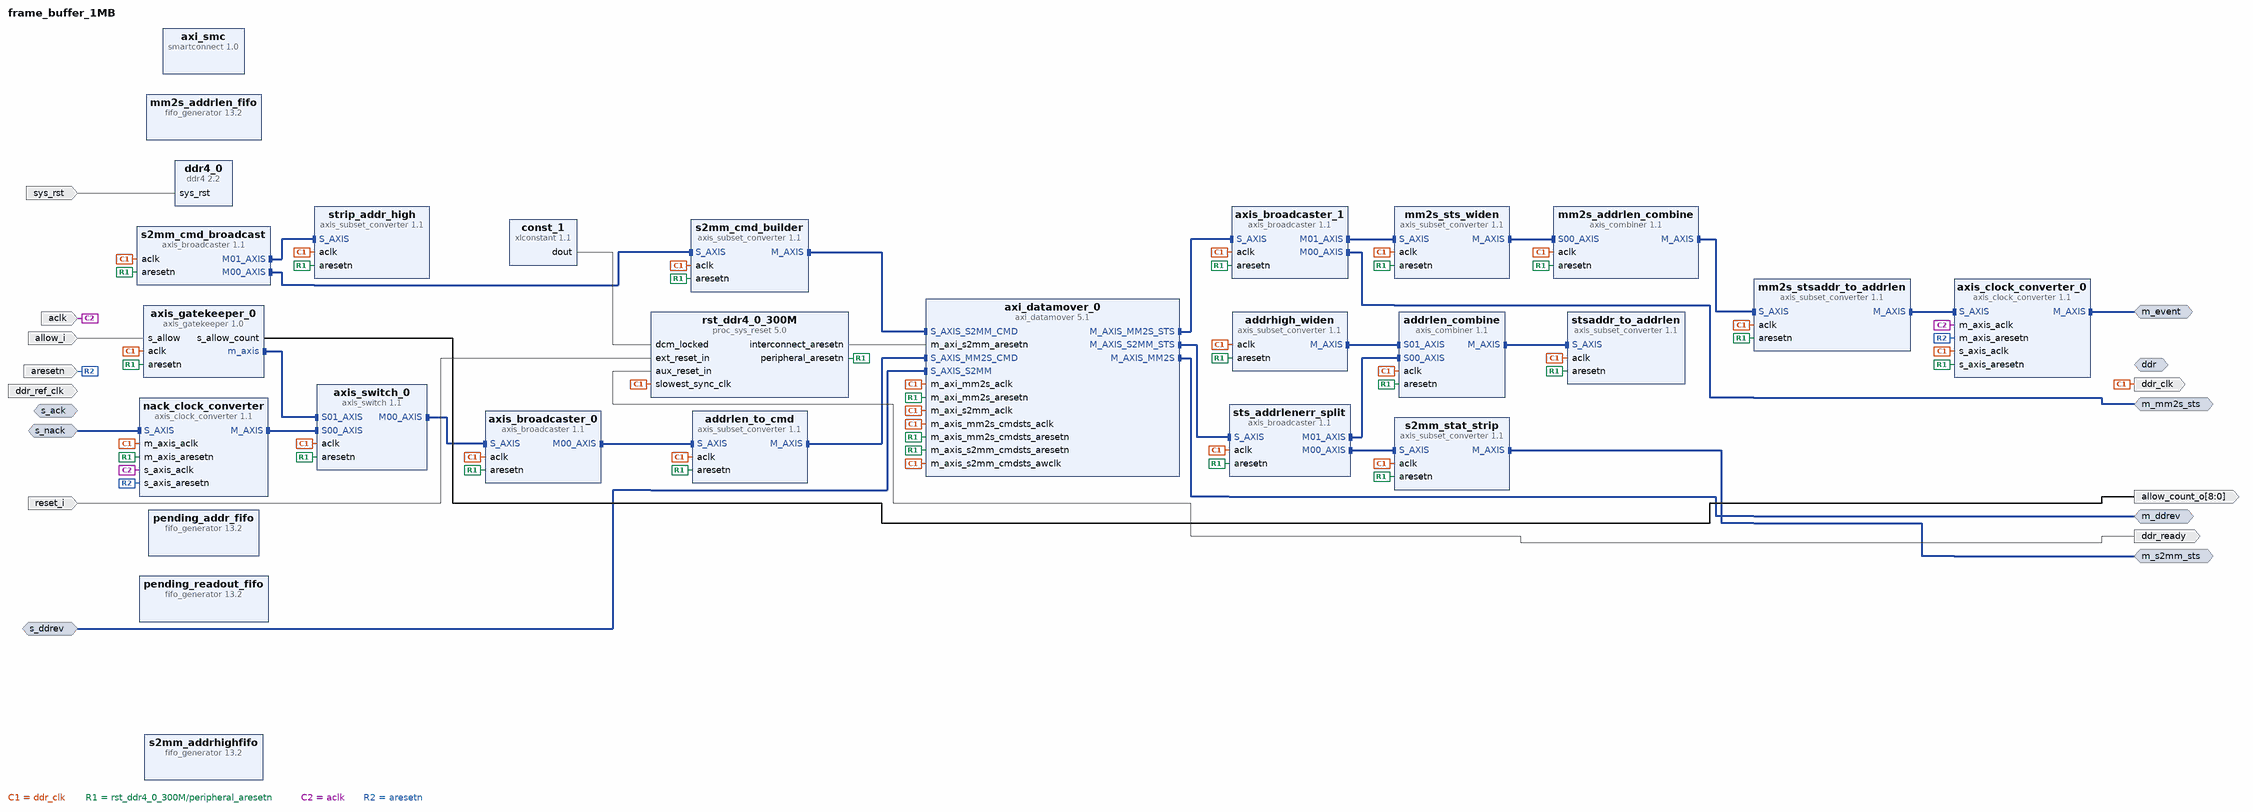
[diagram p0: block diagram of the top level]
# Vivado block design frame_buffer_1MB, xcku3p-ffvb676-2-e, Vivado 2022.2
create_bd_design frame_buffer_1MB

create_bd_intf_port -mode Slave -vlnv xilinx.com:interface:axis_rtl:1.0 s_nack
set_property -dict [list \
  CONFIG.HAS_TKEEP 0 \
  CONFIG.HAS_TLAST 0 \
  CONFIG.HAS_TREADY 1 \
  CONFIG.HAS_TSTRB 0 \
  CONFIG.LAYERED_METADATA undef \
  CONFIG.TDATA_NUM_BYTES 4 \
  CONFIG.TDEST_WIDTH 0 \
  CONFIG.TID_WIDTH 0 \
  CONFIG.TUSER_WIDTH 0 \
] [get_bd_intf_ports s_nack]
create_bd_intf_port -mode Master -vlnv xilinx.com:interface:axis_rtl:1.0 m_s2mm_sts
create_bd_intf_port -mode Master -vlnv xilinx.com:interface:ddr4_rtl:1.0 ddr
create_bd_intf_port -mode Slave -vlnv xilinx.com:interface:axis_rtl:1.0 s_ddrev
set_property -dict [list \
  CONFIG.HAS_TKEEP 1 \
  CONFIG.HAS_TLAST 1 \
  CONFIG.HAS_TREADY 1 \
  CONFIG.HAS_TSTRB 0 \
  CONFIG.LAYERED_METADATA undef \
  CONFIG.TDATA_NUM_BYTES 32 \
  CONFIG.TDEST_WIDTH 0 \
  CONFIG.TID_WIDTH 0 \
  CONFIG.TUSER_WIDTH 0 \
] [get_bd_intf_ports s_ddrev]
create_bd_intf_port -mode Slave -vlnv xilinx.com:interface:axis_rtl:1.0 s_ack
set_property -dict [list \
  CONFIG.FREQ_HZ 156250000 \
  CONFIG.HAS_TKEEP 0 \
  CONFIG.HAS_TLAST 0 \
  CONFIG.HAS_TREADY 1 \
  CONFIG.HAS_TSTRB 0 \
  CONFIG.LAYERED_METADATA undef \
  CONFIG.TDATA_NUM_BYTES 2 \
  CONFIG.TDEST_WIDTH 0 \
  CONFIG.TID_WIDTH 0 \
  CONFIG.TUSER_WIDTH 0 \
] [get_bd_intf_ports s_ack]
create_bd_intf_port -mode Master -vlnv xilinx.com:interface:axis_rtl:1.0 m_ddrev
create_bd_intf_port -mode Master -vlnv xilinx.com:interface:axis_rtl:1.0 m_mm2s_sts
create_bd_intf_port -mode Master -vlnv xilinx.com:interface:axis_rtl:1.0 m_event
set_property -dict {CONFIG.FREQ_HZ 156250000} [get_bd_intf_ports m_event]
create_bd_port -dir I -type clk ddr_ref_clk
set_property -dict {CONFIG.FREQ_HZ 166750000 CONFIG.INSERT_VIP 1 CONFIG.PHASE 0} [get_bd_ports ddr_ref_clk]
create_bd_port -dir I -type rst reset_i
set_property -dict {CONFIG.POLARITY ACTIVE_HIGH} [get_bd_ports reset_i]
create_bd_port -dir I allow_i
create_bd_port -dir O -from 8 -to 0 allow_count_o
create_bd_port -dir O ddr_ready
create_bd_port -dir O -type clk ddr_clk
set_property -dict {CONFIG.ASSOCIATED_BUSIF s_ddrev:m_ddrev:m_mm2s_sts:m_s2mm_sts} [get_bd_ports ddr_clk]
create_bd_port -dir I -type clk aclk
set_property -dict [list \
  CONFIG.ASSOCIATED_BUSIF s_nack:m_event:s_ack \
  CONFIG.ASSOCIATED_RESET aresetn \
  CONFIG.FREQ_HZ 156250000 \
] [get_bd_ports aclk]
create_bd_port -dir I -type rst aresetn
create_bd_port -dir I -type rst sys_rst
set_property -dict {CONFIG.POLARITY ACTIVE_HIGH} [get_bd_ports sys_rst]

create_bd_cell -type ip -vlnv xilinx.com:ip:proc_sys_reset:5.0 rst_ddr4_0_300M
set_property -dict {CONFIG.C_AUX_RESET_HIGH 0} [get_bd_cells rst_ddr4_0_300M]
create_bd_cell -type ip -vlnv ohio-state.edu:user:axis_gatekeeper:1.0 axis_gatekeeper_0
set_property -dict {CONFIG.C_AXIS_DATA_BYTES 4} [get_bd_cells axis_gatekeeper_0]
create_bd_cell -type ip -vlnv xilinx.com:ip:axis_combiner:1.1 mm2s_addrlen_combine
set_property -dict {CONFIG.TDATA_NUM_BYTES 4} [get_bd_cells mm2s_addrlen_combine]
create_bd_cell -type ip -vlnv xilinx.com:ip:axi_datamover:5.1 axi_datamover_0
set_property -dict [list \
  CONFIG.c_dummy 0 \
  CONFIG.c_m_axi_mm2s_data_width 256 \
  CONFIG.c_m_axi_mm2s_id_width 0 \
  CONFIG.c_m_axi_s2mm_data_width 256 \
  CONFIG.c_m_axi_s2mm_id_width 0 \
  CONFIG.c_m_axis_mm2s_tdata_width 256 \
  CONFIG.c_mm2s_btt_used 20 \
  CONFIG.c_mm2s_burst_size 16 \
  CONFIG.c_mm2s_include_sf true \
  CONFIG.c_mm2s_stscmd_is_async false \
  CONFIG.c_s2mm_btt_used 20 \
  CONFIG.c_s2mm_burst_size 16 \
  CONFIG.c_s2mm_stscmd_is_async false \
  CONFIG.c_s2mm_support_indet_btt true \
  CONFIG.c_s_axis_s2mm_tdata_width 256 \
  CONFIG.c_single_interface 1 \
] [get_bd_cells axi_datamover_0]
create_bd_cell -type ip -vlnv xilinx.com:ip:smartconnect:1.0 axi_smc
set_property -dict {CONFIG.NUM_SI 1} [get_bd_cells axi_smc]
create_bd_cell -type ip -vlnv xilinx.com:ip:axis_broadcaster:1.1 sts_addrlenerr_split
set_property -dict [list \
  CONFIG.M00_TDATA_REMAP {24'b000000000000000000000000,tdata[7:0]} \
  CONFIG.M01_TDATA_REMAP {tdata[31:8],4'b0000,tdata[3:0]} \
  CONFIG.M02_TDATA_REMAP {tdata[7:0]} \
  CONFIG.M03_TDATA_REMAP {tdata[7:0]} \
  CONFIG.M_TDATA_NUM_BYTES 4 \
  CONFIG.NUM_MI 2 \
  CONFIG.S_TDATA_NUM_BYTES 4 \
] [get_bd_cells sts_addrlenerr_split]
create_bd_cell -type ip -vlnv xilinx.com:ip:axis_broadcaster:1.1 axis_broadcaster_0
set_property -dict [list \
  CONFIG.M00_TDATA_REMAP {tdata[31:0]} \
  CONFIG.M01_TDATA_REMAP {tdata[31:24],4'b0000,tdata[19:0]} \
  CONFIG.M_TDATA_NUM_BYTES 4 \
  CONFIG.S_TDATA_NUM_BYTES 4 \
] [get_bd_cells axis_broadcaster_0]
create_bd_cell -type ip -vlnv xilinx.com:ip:axis_broadcaster:1.1 s2mm_cmd_broadcast
set_property -dict [list \
  CONFIG.M00_TDATA_REMAP {4'b0000,tdata[11:0]} \
  CONFIG.M01_TDATA_REMAP {4'b0000,tdata[11:0]} \
  CONFIG.M_TDATA_NUM_BYTES 2 \
  CONFIG.S_TDATA_NUM_BYTES 2 \
] [get_bd_cells s2mm_cmd_broadcast]
create_bd_cell -type ip -vlnv xilinx.com:ip:axis_broadcaster:1.1 axis_broadcaster_1
create_bd_cell -type ip -vlnv xilinx.com:ip:axis_clock_converter:1.1 nack_clock_converter
set_property -dict {CONFIG.TDATA_NUM_BYTES 4} [get_bd_cells nack_clock_converter]
create_bd_cell -type ip -vlnv xilinx.com:ip:axis_clock_converter:1.1 axis_clock_converter_0
set_property -dict {CONFIG.TDATA_NUM_BYTES 4} [get_bd_cells axis_clock_converter_0]
create_bd_cell -type ip -vlnv xilinx.com:ip:axis_combiner:1.1 addrlen_combine
set_property -dict {CONFIG.TDATA_NUM_BYTES 4} [get_bd_cells addrlen_combine]
create_bd_cell -type ip -vlnv xilinx.com:ip:axis_subset_converter:1.1 stsaddr_to_addrlen
set_property -dict [list \
  CONFIG.M_TDATA_NUM_BYTES 4 \
  CONFIG.S_TDATA_NUM_BYTES 8 \
  CONFIG.TDATA_REMAP {tdata[39:32],tdata[3:0],tdata[27:8]} \
  CONFIG.TKEEP_REMAP {tkeep[3:0]} \
  CONFIG.TLAST_REMAP {tlast[0]} \
] [get_bd_cells stsaddr_to_addrlen]
create_bd_cell -type ip -vlnv xilinx.com:ip:axis_subset_converter:1.1 s2mm_cmd_builder
set_property -dict [list \
  CONFIG.M_TDATA_NUM_BYTES 9 \
  CONFIG.S_TDATA_NUM_BYTES 2 \
  CONFIG.TDATA_REMAP {4'b0000,tdata[3:0],tdata[11:0],20'b00000000000000000000,1'b0,1'b1,6'b000000,1'b1,3'b000,20'b11111111111111111111} \
] [get_bd_cells s2mm_cmd_builder]
create_bd_cell -type ip -vlnv xilinx.com:ip:axis_subset_converter:1.1 strip_addr_high
set_property -dict [list \
  CONFIG.M_TDATA_NUM_BYTES 1 \
  CONFIG.S_TDATA_NUM_BYTES 2 \
  CONFIG.TDATA_REMAP {tdata[11:4]} \
] [get_bd_cells strip_addr_high]
create_bd_cell -type ip -vlnv xilinx.com:ip:axis_subset_converter:1.1 s2mm_stat_strip
set_property -dict [list \
  CONFIG.TDATA_REMAP {tdata[31:0]} \
  CONFIG.TKEEP_REMAP {tkeep[3:0]} \
  CONFIG.TLAST_REMAP {tlast[0]} \
] [get_bd_cells s2mm_stat_strip]
create_bd_cell -type ip -vlnv xilinx.com:ip:axis_subset_converter:1.1 addrhigh_widen
set_property -dict [list \
  CONFIG.M_TDATA_NUM_BYTES 4 \
  CONFIG.TDATA_REMAP {24'b000000000000000000000000,tdata[7:0]} \
] [get_bd_cells addrhigh_widen]
create_bd_cell -type ip -vlnv xilinx.com:ip:axis_subset_converter:1.1 addrlen_to_cmd
set_property -dict [list \
  CONFIG.M_TDATA_NUM_BYTES 9 \
  CONFIG.S_TDATA_NUM_BYTES 4 \
  CONFIG.TDATA_REMAP {4'b0000,tdata[23:20],tdata[31:20],20'b00000000000000000000,1'b0,1'b1,6'b000000,1'b1,3'b000,tdata[19:0]} \
] [get_bd_cells addrlen_to_cmd]
create_bd_cell -type ip -vlnv xilinx.com:ip:axis_subset_converter:1.1 mm2s_sts_widen
set_property -dict [list \
  CONFIG.M_TDATA_NUM_BYTES 4 \
  CONFIG.TDATA_REMAP {24'b000000000000000000000000,tdata[7:0]} \
  CONFIG.TKEEP_REMAP {3'b111,tkeep[0:0]} \
  CONFIG.TLAST_REMAP {tlast[0]} \
] [get_bd_cells mm2s_sts_widen]
create_bd_cell -type ip -vlnv xilinx.com:ip:axis_switch:1.1 axis_switch_0
set_property -dict {CONFIG.ARB_ALGORITHM 1 CONFIG.TDATA_NUM_BYTES 4} [get_bd_cells axis_switch_0]
create_bd_cell -type ip -vlnv xilinx.com:ip:ddr4:2.2 ddr4_0
set_property -dict [list \
  CONFIG.ADDN_UI_CLKOUT1_FREQ_HZ 167 \
  CONFIG.C0.DDR4_AxiAddressWidth 32 \
  CONFIG.C0.DDR4_AxiDataWidth 256 \
  CONFIG.C0.DDR4_CasWriteLatency 12 \
  CONFIG.C0.DDR4_DataWidth 32 \
  CONFIG.C0.DDR4_InputClockPeriod 5997 \
  CONFIG.C0.DDR4_MemoryPart MT40A1G8WE-075E \
  CONFIG.C0.DDR4_TimePeriod 833 \
  CONFIG.C0.DDR4_nCK_TXPR 0 \
  CONFIG.System_Clock No_Buffer \
] [get_bd_cells ddr4_0]
create_bd_cell -type ip -vlnv xilinx.com:ip:fifo_generator:13.2 pending_readout_fifo
set_property -dict [list \
  CONFIG.FIFO_Implementation_axis Common_Clock_Builtin_FIFO \
  CONFIG.FIFO_Implementation_rach Common_Clock_Distributed_RAM \
  CONFIG.FIFO_Implementation_rdch Common_Clock_Builtin_FIFO \
  CONFIG.FIFO_Implementation_wach Common_Clock_Distributed_RAM \
  CONFIG.FIFO_Implementation_wdch Common_Clock_Builtin_FIFO \
  CONFIG.FIFO_Implementation_wrch Common_Clock_Distributed_RAM \
  CONFIG.INTERFACE_TYPE AXI_STREAM \
  CONFIG.TDATA_NUM_BYTES 4 \
  CONFIG.TUSER_WIDTH 0 \
] [get_bd_cells pending_readout_fifo]
create_bd_cell -type ip -vlnv xilinx.com:ip:fifo_generator:13.2 mm2s_addrlen_fifo
set_property -dict [list \
  CONFIG.FIFO_Implementation_axis Common_Clock_Distributed_RAM \
  CONFIG.FIFO_Implementation_rach Common_Clock_Distributed_RAM \
  CONFIG.FIFO_Implementation_rdch Common_Clock_Builtin_FIFO \
  CONFIG.FIFO_Implementation_wach Common_Clock_Distributed_RAM \
  CONFIG.FIFO_Implementation_wdch Common_Clock_Builtin_FIFO \
  CONFIG.FIFO_Implementation_wrch Common_Clock_Distributed_RAM \
  CONFIG.INTERFACE_TYPE AXI_STREAM \
  CONFIG.Input_Depth_axis 16 \
  CONFIG.TDATA_NUM_BYTES 4 \
  CONFIG.TUSER_WIDTH 0 \
] [get_bd_cells mm2s_addrlen_fifo]
create_bd_cell -type ip -vlnv xilinx.com:ip:fifo_generator:13.2 pending_addr_fifo
set_property -dict [list \
  CONFIG.Clock_Type_AXI Independent_Clock \
  CONFIG.FIFO_Implementation_axis Independent_Clocks_Builtin_FIFO \
  CONFIG.FIFO_Implementation_rach Independent_Clocks_Distributed_RAM \
  CONFIG.FIFO_Implementation_rdch Independent_Clocks_Builtin_FIFO \
  CONFIG.FIFO_Implementation_wach Independent_Clocks_Distributed_RAM \
  CONFIG.FIFO_Implementation_wdch Independent_Clocks_Builtin_FIFO \
  CONFIG.FIFO_Implementation_wrch Independent_Clocks_Distributed_RAM \
  CONFIG.INTERFACE_TYPE AXI_STREAM \
  CONFIG.Input_Depth_axis 4096 \
  CONFIG.TDATA_NUM_BYTES 2 \
  CONFIG.TUSER_WIDTH 0 \
] [get_bd_cells pending_addr_fifo]
create_bd_cell -type ip -vlnv xilinx.com:ip:fifo_generator:13.2 s2mm_addrhighfifo
set_property -dict [list \
  CONFIG.FIFO_Implementation_axis Common_Clock_Distributed_RAM \
  CONFIG.FIFO_Implementation_rach Common_Clock_Distributed_RAM \
  CONFIG.FIFO_Implementation_rdch Common_Clock_Builtin_FIFO \
  CONFIG.FIFO_Implementation_wach Common_Clock_Distributed_RAM \
  CONFIG.FIFO_Implementation_wdch Common_Clock_Builtin_FIFO \
  CONFIG.FIFO_Implementation_wrch Common_Clock_Distributed_RAM \
  CONFIG.Fifo_Implementation Common_Clock_Distributed_RAM \
  CONFIG.Full_Flags_Reset_Value 1 \
  CONFIG.INTERFACE_TYPE AXI_STREAM \
  CONFIG.Input_Depth_axis 16 \
  CONFIG.TUSER_WIDTH 0 \
] [get_bd_cells s2mm_addrhighfifo]
create_bd_cell -type ip -vlnv xilinx.com:ip:axis_subset_converter:1.1 mm2s_stsaddr_to_addrlen
set_property -dict [list \
  CONFIG.M_TDATA_NUM_BYTES 4 \
  CONFIG.S_TDATA_NUM_BYTES 8 \
  CONFIG.TDATA_REMAP {tdata[63:56],tdata[3:0],tdata[51:32]} \
  CONFIG.TKEEP_REMAP {tkeep[3:0]} \
  CONFIG.TLAST_REMAP {tlast[0]} \
] [get_bd_cells mm2s_stsaddr_to_addrlen]
create_bd_cell -type ip -vlnv xilinx.com:ip:xlconstant:1.1 const_1

# ---- connections ----

connect_bd_intf_net -intf_net S_AXIS_S2MM_0_1 [get_bd_intf_ports s_ddrev] [get_bd_intf_pins axi_datamover_0/S_AXIS_S2MM]
connect_bd_intf_net [get_bd_intf_pins addrlen_combine/M_AXIS] [get_bd_intf_pins stsaddr_to_addrlen/S_AXIS]
connect_bd_intf_net [get_bd_intf_pins addrlen_to_cmd/M_AXIS] [get_bd_intf_pins axi_datamover_0/S_AXIS_MM2S_CMD]
connect_bd_intf_net [get_bd_intf_ports m_ddrev] [get_bd_intf_pins axi_datamover_0/M_AXIS_MM2S]
connect_bd_intf_net [get_bd_intf_pins axi_datamover_0/M_AXIS_MM2S_STS] [get_bd_intf_pins axis_broadcaster_1/S_AXIS]
connect_bd_intf_net [get_bd_intf_pins axi_datamover_0/M_AXIS_S2MM_STS] [get_bd_intf_pins sts_addrlenerr_split/S_AXIS]
connect_bd_intf_net -intf_net axis_broadcaster_0_M00_AXIS [get_bd_intf_pins sts_addrlenerr_split/M00_AXIS] [get_bd_intf_pins s2mm_stat_strip/S_AXIS]
connect_bd_intf_net [get_bd_intf_pins axis_broadcaster_0/M00_AXIS] [get_bd_intf_pins addrlen_to_cmd/S_AXIS]
connect_bd_intf_net [get_bd_intf_ports m_mm2s_sts] [get_bd_intf_pins axis_broadcaster_1/M00_AXIS]
connect_bd_intf_net [get_bd_intf_pins axis_broadcaster_1/M01_AXIS] [get_bd_intf_pins mm2s_sts_widen/S_AXIS]
connect_bd_intf_net -intf_net axis_clock_converter_0_M_AXIS [get_bd_intf_pins axis_switch_0/S00_AXIS] [get_bd_intf_pins nack_clock_converter/M_AXIS]
connect_bd_intf_net [get_bd_intf_ports m_event] [get_bd_intf_pins axis_clock_converter_0/M_AXIS]
connect_bd_intf_net [get_bd_intf_pins axis_gatekeeper_0/m_axis] [get_bd_intf_pins axis_switch_0/S01_AXIS]
connect_bd_intf_net -intf_net axis_subset_converter_0_M_AXIS1 [get_bd_intf_pins addrhigh_widen/M_AXIS] [get_bd_intf_pins addrlen_combine/S01_AXIS]
connect_bd_intf_net [get_bd_intf_pins axis_switch_0/M00_AXIS] [get_bd_intf_pins axis_broadcaster_0/S_AXIS]
connect_bd_intf_net [get_bd_intf_pins mm2s_addrlen_combine/M_AXIS] [get_bd_intf_pins mm2s_stsaddr_to_addrlen/S_AXIS]
connect_bd_intf_net [get_bd_intf_pins mm2s_sts_widen/M_AXIS] [get_bd_intf_pins mm2s_addrlen_combine/S00_AXIS]
connect_bd_intf_net [get_bd_intf_pins mm2s_stsaddr_to_addrlen/M_AXIS] [get_bd_intf_pins axis_clock_converter_0/S_AXIS]
connect_bd_intf_net [get_bd_intf_pins s2mm_cmd_broadcast/M00_AXIS] [get_bd_intf_pins s2mm_cmd_builder/S_AXIS]
connect_bd_intf_net [get_bd_intf_pins strip_addr_high/S_AXIS] [get_bd_intf_pins s2mm_cmd_broadcast/M01_AXIS]
connect_bd_intf_net [get_bd_intf_pins s2mm_cmd_builder/M_AXIS] [get_bd_intf_pins axi_datamover_0/S_AXIS_S2MM_CMD]
connect_bd_intf_net [get_bd_intf_ports m_s2mm_sts] [get_bd_intf_pins s2mm_stat_strip/M_AXIS]
connect_bd_intf_net [get_bd_intf_ports s_nack] [get_bd_intf_pins nack_clock_converter/S_AXIS]
connect_bd_intf_net [get_bd_intf_pins sts_addrlenerr_split/M01_AXIS] [get_bd_intf_pins addrlen_combine/S00_AXIS]
connect_bd_net -net aux_reset_in_0_1 [get_bd_ports reset_i] [get_bd_pins rst_ddr4_0_300M/ext_reset_in]
connect_bd_net [get_bd_pins axis_gatekeeper_0/s_allow_count] [get_bd_ports allow_count_o]
# net c0_sys_clk_i_0_1 has one end: ddr_ref_clk
connect_bd_net [get_bd_pins const_1/dout] [get_bd_pins rst_ddr4_0_300M/dcm_locked]
connect_bd_net -net ddr4_0_c0_ddr4_ui_clk [get_bd_ports ddr_clk] \
  [get_bd_pins rst_ddr4_0_300M/slowest_sync_clk] [get_bd_pins axis_gatekeeper_0/aclk] [get_bd_pins mm2s_addrlen_combine/aclk] \
  [get_bd_pins axi_datamover_0/m_axi_mm2s_aclk] [get_bd_pins axi_datamover_0/m_axis_mm2s_cmdsts_aclk] \
  [get_bd_pins axi_datamover_0/m_axi_s2mm_aclk] [get_bd_pins axi_datamover_0/m_axis_s2mm_cmdsts_awclk] \
  [get_bd_pins sts_addrlenerr_split/aclk] [get_bd_pins axis_broadcaster_0/aclk] [get_bd_pins s2mm_cmd_broadcast/aclk] \
  [get_bd_pins axis_broadcaster_1/aclk] [get_bd_pins nack_clock_converter/m_axis_aclk] \
  [get_bd_pins axis_clock_converter_0/s_axis_aclk] [get_bd_pins addrlen_combine/aclk] [get_bd_pins stsaddr_to_addrlen/aclk] \
  [get_bd_pins s2mm_cmd_builder/aclk] [get_bd_pins strip_addr_high/aclk] [get_bd_pins s2mm_stat_strip/aclk] \
  [get_bd_pins addrhigh_widen/aclk] [get_bd_pins addrlen_to_cmd/aclk] [get_bd_pins mm2s_sts_widen/aclk] \
  [get_bd_pins axis_switch_0/aclk] [get_bd_pins mm2s_stsaddr_to_addrlen/aclk]
connect_bd_net -net ddr4_0_c0_init_calib_complete [get_bd_ports ddr_ready] [get_bd_pins rst_ddr4_0_300M/aux_reset_in]
connect_bd_net [get_bd_pins rst_ddr4_0_300M/interconnect_aresetn] [get_bd_pins axi_datamover_0/m_axi_s2mm_aresetn]
connect_bd_net [get_bd_pins rst_ddr4_0_300M/peripheral_aresetn] \
  [get_bd_pins axis_gatekeeper_0/aresetn] [get_bd_pins mm2s_addrlen_combine/aresetn] \
  [get_bd_pins axi_datamover_0/m_axi_mm2s_aresetn] [get_bd_pins axi_datamover_0/m_axis_mm2s_cmdsts_aresetn] \
  [get_bd_pins axi_datamover_0/m_axis_s2mm_cmdsts_aresetn] [get_bd_pins sts_addrlenerr_split/aresetn] \
  [get_bd_pins axis_broadcaster_0/aresetn] [get_bd_pins s2mm_cmd_broadcast/aresetn] [get_bd_pins axis_broadcaster_1/aresetn] \
  [get_bd_pins nack_clock_converter/m_axis_aresetn] [get_bd_pins axis_clock_converter_0/s_axis_aresetn] \
  [get_bd_pins addrlen_combine/aresetn] [get_bd_pins stsaddr_to_addrlen/aresetn] [get_bd_pins s2mm_cmd_builder/aresetn] \
  [get_bd_pins strip_addr_high/aresetn] [get_bd_pins s2mm_stat_strip/aresetn] [get_bd_pins addrhigh_widen/aresetn] \
  [get_bd_pins addrlen_to_cmd/aresetn] [get_bd_pins mm2s_sts_widen/aresetn] [get_bd_pins axis_switch_0/aresetn] \
  [get_bd_pins mm2s_stsaddr_to_addrlen/aresetn]
connect_bd_net -net s_aclk_0_1 [get_bd_ports aclk] [get_bd_pins nack_clock_converter/s_axis_aclk] [get_bd_pins axis_clock_converter_0/m_axis_aclk]
connect_bd_net -net s_allow_0_1 [get_bd_ports allow_i] [get_bd_pins axis_gatekeeper_0/s_allow]
connect_bd_net -net s_aresetn_0_1 [get_bd_ports aresetn] \
  [get_bd_pins nack_clock_converter/s_axis_aresetn] [get_bd_pins axis_clock_converter_0/m_axis_aresetn]
connect_bd_net -net sys_rst_0_1 [get_bd_ports sys_rst] [get_bd_pins ddr4_0/sys_rst]

validate_bd_design
save_bd_design
